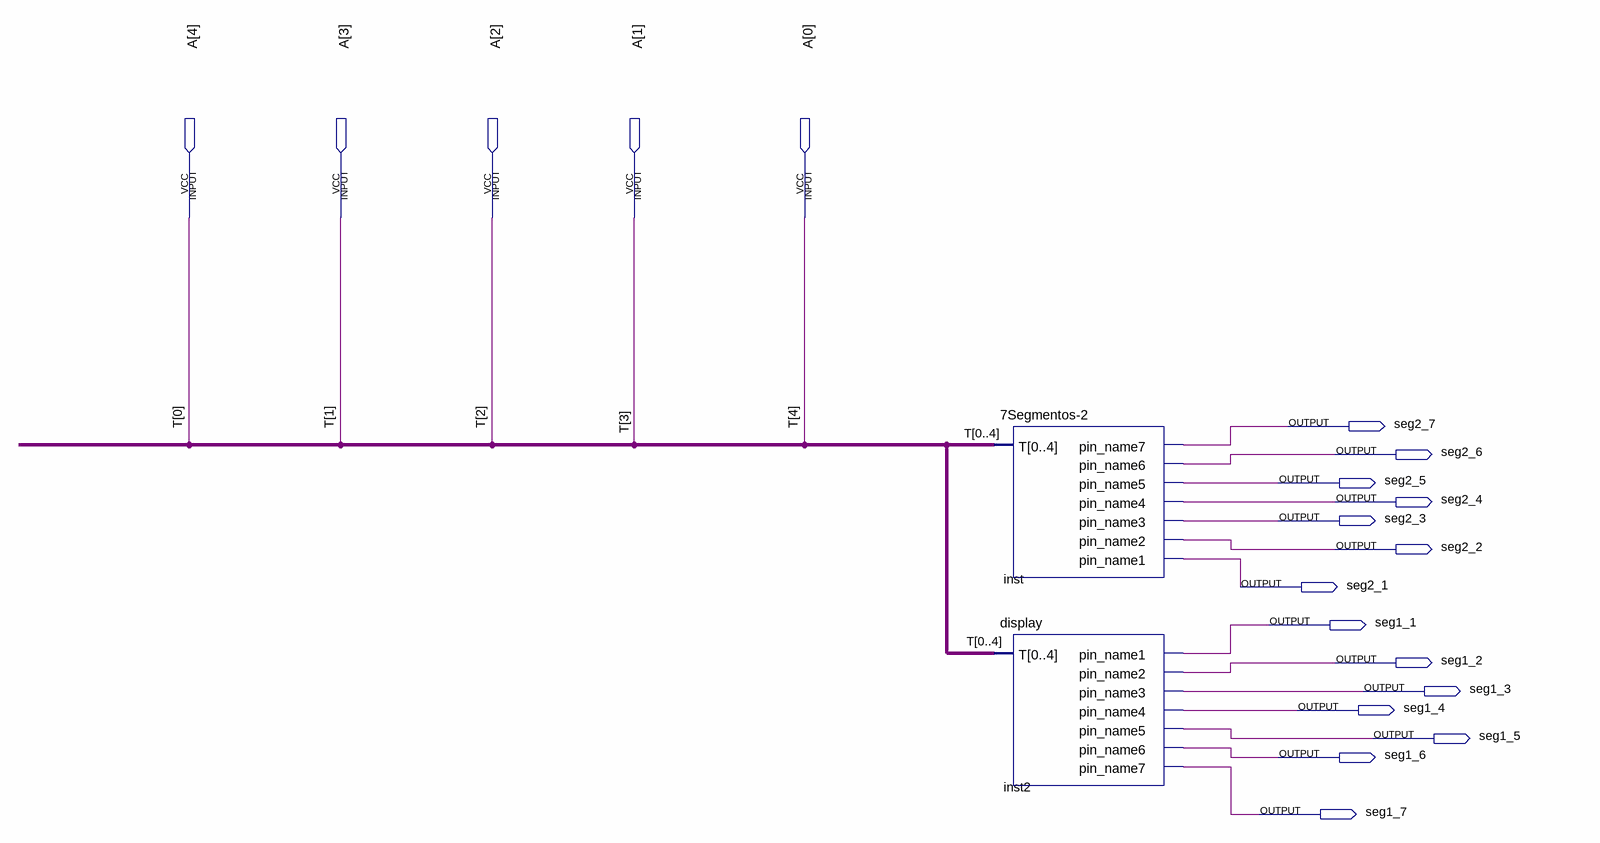
[diagram p0: schematic sheet]
// Quartus schematic 7Segmentos5bits.bdf as structural Verilog: 2 symbols, 19 pins
module \7Segmentos5bits  (
  input  [4:0] A,
  output seg2_7,
  output seg2_6,
  output seg2_5,
  output seg2_4,
  output seg2_3,
  output seg2_2,
  output seg2_1,
  output seg1_1,
  output seg1_2,
  output seg1_3,
  output seg1_4,
  output seg1_5,
  output seg1_6,
  output seg1_7
);

  \7Segmentos-2  inst (
    .T(A), .pin_name7(seg2_7), .pin_name6(seg2_6), .pin_name5(seg2_5), .pin_name4(seg2_4),
    .pin_name3(seg2_3), .pin_name2(seg2_2), .pin_name1(seg2_1));
  display inst2 (
    .T(A), .pin_name1(seg1_1), .pin_name2(seg1_2), .pin_name3(seg1_3), .pin_name4(seg1_4),
    .pin_name5(seg1_5), .pin_name6(seg1_6), .pin_name7(seg1_7));

  // Other names for the same wires on the sheet: T[4:0] = {A[0], A[1], A[2], A[3], A[4]}
endmodule
